# Altium project GPIO_Module.PrjPcb
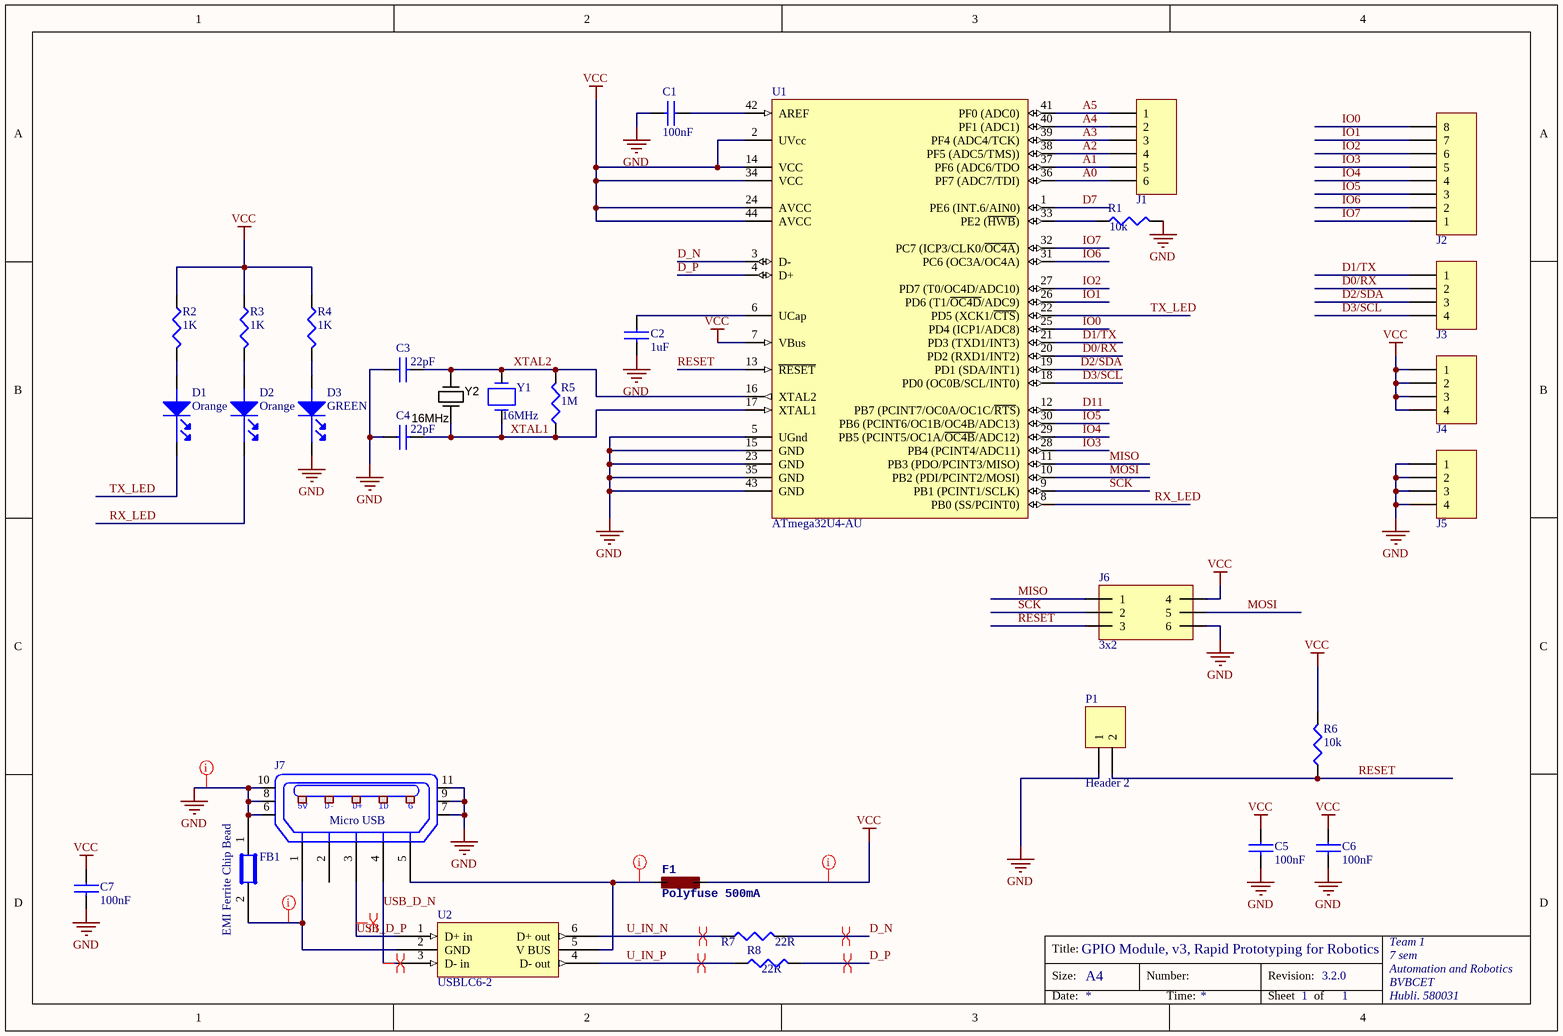
[diagram p0: schematic.SchDoc]
1 sheet, 32 parts. Net scope: global (net labels, ports and power ports of the same name join across sheets).
Board file: pcb.PcbDoc

## Sheet schematic.SchDoc
size A4; Organization: Team 1; Address1: 7 sem; Address2: Automation and Robotics; Address3: BVBCET; Address4: Hubli. 580031

### Parts
C1  100nF  [C0805]
C2  1uF  [C0805]
C3  22pF  [C0805]
C4  22pF  [C0805]
C5  100nF  [C0805]
C6  100nF  [C0805]
C7  100nF  [C0805]
D1  Orange  [LED_0603]
D2  Orange  [LED_0603]
D3  GREEN  [LED_0603]
F1  Polyfuse 500mA  [L1812]
FB1  EMI Ferrite Chip Bead  [C0805]
J1  06p  [61300611821]  (value not drawn)
J2  08p  [61300811821]  (value not drawn)
J3  04p  [61300411821]  (value not drawn)
J4  04p  [61300411821]  (value not drawn)
J5  04p  [61300411821]  (value not drawn)
J6  3x2  [Male 3x2]
J7  Micro USB  [10118193]
P1  Header 2  [HDR1X2]
R1  10k  [R0805]
R2  1K  [R0805]
R3  1K  [R0805]
R4  1K  [R0805]
R5  1M  [R0805]
R6  10k  [R0805]
R7  22R  [R0805]
R8  22R  [R0805]
U1  ATmega32U4-AU  [44ML_M]
U2  USBLC6-2  [TSOT23-6]
Y1  16MHz  [ABM7_v1_1_BIG]
Y2  16MHz  [CRYSTAL_HC49-US-SM]

### Nets
GND: C1.2 C2.2 C3.1 C4.1 C5.2 C6.2 C7.2 D3.1(cathode) FB1.1 J5.1 J5.2 J5.3 J5.4 J6.6 J7.6 J7.7 J7.8 J7.9 J7.10 J7.11 P1.1 R1.2 U1.5(UGnd) U1.15(GND) U1.23(GND) U1.35(GND) U1.43(GND)
VCC: C5.1 C6.1 C7.1 F1.2 J4.1 J4.2 J4.3 J4.4 J6.4 R2.1 R3.1 R4.1 R6.2 U1.2(UVcc) U1.7(VBus) U1.14(VCC) U1.24(AVCC) U1.34(VCC) U1.44(AVCC)
A0: J1.6 U1.36(PF7_(ADC7/TDI))
A1: J1.5 U1.37(PF6_(ADC6/TDO)
A2: J1.4 U1.38(PF5_(ADC5/TMS)))
A3: J1.3 U1.39(PF4_(ADC4/TCK))
A4: J1.2 U1.40(PF1_(ADC1))
A5: J1.1 U1.41(PF0_(ADC0))
D0/RX: J3.2 U1.20(PD2_(RXD1/INT2))
D1/TX: J3.1 U1.21(PD3_(TXD1/INT3))
D2/SDA: J3.3 U1.19(PD1_(SDA/INT1))
D3/SCL: J3.4 U1.18(PD0_(OC0B/SCL/INT0))
D7: U1.1(PE6_(INT.6/AIN0))
D11: U1.12(PB7_(PCINT7/OC0A/OC1C/~{RTS}))
D_N: R7.2 U1.3(D-)
D_P: R8.2 U1.4(D+)
IO0: J2.8 U1.25(PD4_(ICP1/ADC8))
IO1: J2.7 U1.26(PD6_(T1/~{OC4D}/ADC9))
IO2: J2.6 U1.27(PD7_(T0/OC4D/ADC10))
IO3: J2.5 U1.28(PB4_(PCINT4/ADC11))
IO4: J2.4 U1.29(PB5_(PCINT5/OC1A/~{OC4B}/ADC12))
IO5: J2.3 U1.30(PB6_(PCINT6/OC1B/OC4B/ADC13))
IO6: J2.2 U1.31(PC6_(OC3A/OC4A))
IO7: J2.1 U1.32(PC7_(ICP3/CLK0/~{OC4A}))
MISO: J6.1 U1.11(PB3_(PDO/PCINT3/MISO))
MOSI: J6.5 U1.10(PB2_(PDI/PCINT2/MOSI))
RESET: J6.3 P1.2 R6.1 U1.13(~{RESET})
RX_LED: D2.1(cathode) U1.8(PB0_(SS/PCINT0))
SCK: J6.2 U1.9(PB1_(PCINT1/SCLK))
TX_LED: D1.1(cathode) U1.22(PD5_(XCK1/~{CTS}))
U_IN_N: R7.1 U2.6(D+_out)
U_IN_P: R8.1 U2.4(D-_out)
USB_D_N: J7.4(P4) U2.3(D-_in)
USB_D_P: J7.3(P3) U2.1(D+_in)
XTAL1: C4.2 R5.1 U1.17(XTAL1) Y1.1 Y2.1(IN)
XTAL2: C3.2 R5.2 U1.16(XTAL2) Y1.2 Y2.2(OUT)
NetC1_1: C1.1 U1.42(AREF)
NetC2_1: C2.1 U1.6(UCap)
NetD1_2: D1.2(ANODE) R2.2
NetD2_2: D2.2(ANODE) R3.2
NetD3_2: D3.2(ANODE) R4.2
NetF1_1: F1.1 J7.5(P5) U2.5(V_BUS)
NetFB1_2: FB1.2 J7.1(P1) U2.2(GND)
NetR1_1: R1.1 U1.33(PE2_(~{HWB}))

Not connected (* = marked no-connect by the designer): J7 2(P2)

### Layout directives
net class power_class: GND, NetF1_1, NetFB1_2, VCC
differential pair; net class USB: D_N, D_P, U_IN_N, U_IN_P
differential pair: USB_D_N, USB_D_P

### Notes on the sheet
- GPIO Module, v3, Rapid Prototyping for Robotics
- 3.2.0
- 1
- Title:
- Size:
- A4
- Number:
- Revision:
- Date:
- Time:
- Sheet
- of
- (in symbol 10118193-0001LF) 5V; D-; D+; ID; G

### Library data of the parts
C1 = C2012X5R1C106M: CAP CER 16V 20% X5R 0805; Manufacturer: TDK Corporation; Manufacturer Part Number: C2012X5R1C106M/1.25; Capacitance: 10µF; Voltage - Rated: 50V; .Checked PCB: used; Supplier 1: Digi-Key; Supplier Part Number 1: 445-4115-1-ND; RoHS: RoHS Compliant; Category: Capacitors; Stock 1: 66161; Pricing 1: 1=0.45, 10=0.357, 100=0.215, 250=0.16124, 500=0.1376, 1000=0.1075 (USD); Tolerance: ±20%; Temperature Coefficient: X5R; Mounting Type: Surface Mount, MLCC; Operating Temperature: -55°C ~ 85°C; Applications: General Purpose; Ratings: -; Package / Case: 0805 (2012 Metric); Size / Dimension: 0.079" L x 0.049" W (2.00mm x 1.25mm); Height - Seated (Max): -; Thickness (Max): 0.039" (1.00mm); Lead Spacing: -; Features: -; Packaging: Cut Tape (CT); Lead Style: -; ComponentLink1URL: http://www.tdk.com/pdf/general_B11.pdf; ComponentLink1Description: http://www.tdk.com/pdf/general_B11.pdf; .Checked SCH: used; value: 100nF
C2 = C2012X5R1C106M: CAP CER 16V 20% X5R 0805; Manufacturer: TDK Corporation; Manufacturer Part Number: C2012X5R1C106M/1.25; Capacitance: 10µF; .Checked PCB: used; Supplier 1: Digi-Key; Supplier Part Number 1: 445-4115-1-ND; RoHS: RoHS Compliant; Category: Capacitors; Stock 1: 66161; Pricing 1: 1=0.45, 10=0.357, 100=0.215, 250=0.16124, 500=0.1376, 1000=0.1075 (USD); Voltage - Rated: 16V; Tolerance: ±20%; Temperature Coefficient: X5R; Mounting Type: Surface Mount, MLCC; Operating Temperature: -55°C ~ 85°C; Applications: General Purpose; Ratings: -; Package / Case: 0805 (2012 Metric); Size / Dimension: 0.079" L x 0.049" W (2.00mm x 1.25mm); Height - Seated (Max): -; Thickness (Max): 0.039" (1.00mm); Lead Spacing: -; Features: -; Packaging: Cut Tape (CT); Lead Style: -; ComponentLink1URL: http://www.tdk.com/pdf/general_B11.pdf; ComponentLink1Description: http://www.tdk.com/pdf/general_B11.pdf; .Checked SCH: used; value: 1uF
C3 C4 = C0805C180J5GACTU: CAP CER 22pF 50V 5% NP0 0805; Manufacturer: Kemet; Capacitance: 18pF; Temperature Coefficient: C0G, NP0; .Creator: MM; .Checked PCB: RF; Supplier 1: Digi-Key; Manufacturer Part Number: C0805C180J5GACTU; RoHS: RoHS Compliant; Category: Capacitors; Stock 1: 39241; Pricing 1: 1=0.11, 10=0.083, 25=0.0588, 50=0.045, 100=0.0381, 250=0.0312, 1000=0.0204 (USD); Packaging: Cut Tape (CT); Tolerance: ±5%; Voltage - Rated: 50V; Mounting Type: Surface Mount, MLCC; Operating Temperature: -55°C ~ 125°C; Applications: General Purpose; Ratings: -; Package / Case: 0805 (2012 Metric); Size / Dimension: 0.079" L x 0.049" W (2.00mm x 1.25mm); Height - Seated (Max): -; Thickness (Max): 0.035" (0.88mm); Lead Spacing: -; Features: -; Lead Style: -; ComponentLink1URL: http://www.kemet.com/docfinder?Partnumber=C0805C180J5GACTU; ComponentLink1Description: http://www.kemet.com/docfinder?Partnumber=C0805C180J5GACTU; Supplier Part Number 1: 399-1112-1-ND; .Checked SCH: RF; value: 22pF
C5-C7 = C2012X7R1H104K085AA: CAP CER 0.1UF 50V 10% X7R 0805; Manufacturer: TDK Corporation; Capacitance: 0.1µF; .Creator: MM; .Checked PCB: RF; Supplier 1: Digi-Key; Manufacturer Part Number: C2012X7R1H104K085AA; RoHS: RoHS Compliant; Category: Capacitors; Stock 1: 818066; Pricing 1: 1=0.1, 10=0.066, 100=0.0303, 250=0.02476, 500=0.02118, 1000=0.0165 (USD); Packaging: Cut Tape (CT); Tolerance: ±10%; Voltage - Rated: 50V; Temperature Coefficient: X7R; Mounting Type: Surface Mount, MLCC; Operating Temperature: -55°C ~ 125°C; Applications: General Purpose; Ratings: -; Package / Case: 0805 (2012 Metric); Size / Dimension: 0.079" L x 0.049" W (2.00mm x 1.25mm); Height - Seated (Max): -; Thickness (Max): 0.037" (0.95mm); Lead Spacing: -; Features: -; Lead Style: -; ComponentLink1URL: http://product.tdk.com/en/catalog/datasheets/mlcc_commercial_general_en.pdf; ComponentLink1Description: http://product.tdk.com/en/catalog/datasheets/mlcc_commercial_general_en.pdf; Supplier Part Number 1: 445-7534-1-ND; .Checked SCH: RF; value: 100nF
D1-D3 = LO L29K-H2K1-24-Z: LED SMARTLED ORANGE 606NM 0603; Manufacturer: OSRAM Opto Semiconductors Inc; Millicandela Rating: 6.3mcd; Voltage - Forward (Vf) Typ: 1.8V; Current - Test: 2mA; Wavelength - Peak: 610nm; Viewing Angle: 160°; Lens Type: Diffused; Lens Style/Size: Rectangle with Flat Top, 1.3mm x 0.8mm; Luminous Flux @ Current - Test: 25 mlm; .Checked PCB: used; Supplier 1: Digi-Key; Supplier Part Number 1: 475-2740-1-ND; Manufacturer Part Number: LO L29K-H2K1-24-Z; RoHS: RoHS Compliant; Category: Optoelectronics; Stock 1: 15900; Pricing 1: 1=0.17, 10=0.141, 100=0.1127, 250=0.0986, 500=0.09016 (USD); Color: Orange; Wavelength - Dominant: 606nm; Package / Case: 0603 (1608 Metric); Size / Dimension: 1.70mm L x 0.80mm W; Height: 0.65mm; Mounting Type: Surface Mount; Packaging: Cut Tape (CT); ComponentLink1URL: http://catalog.osram-os.com/catalogue/catalogue.do;jsessionid=302CF83AF637AE24E40AEB0ADA267EDD?act=downloadFile&favOid=020000010003f9de000100b6; ComponentLink1Description: http://catalog.osram-os.com/catalogue/catalogue.do;jsessionid=302CF83AF637AE24E40AEB0ADA267EDD?act=downloadFile&favOid=020000010003f9de000100b6; .Checked SCH: used
F1 = L-EUL1812
FB1 = MPZ2012S601AT000: Multilayer Ferrite Beads, Chip Beads in SMD 0805 package; Manufacturer: Bourns; Manufacturer Part Number: MH2029-300Y; Impedance: 30 Ohm; Current Rating: 3A; RoHS: RoHS Compliant; Category: Ferrite Beads; Package / Case: 0805 (2012 Metric); Mounting Type: Surface Mount
J1 = 61300611821: WR-PHD 2.54 mm Socket Header, 06p; PublishedDate: July 2016; Publisher: Wurth Elektronik; ComponentLink1Description: Manufacturer; ComponentLink1URL: http://www.we-online.de; ComponentLink2Description: Datasheet; ComponentLink2URL: http://katalog.we-online.de/em/datasheet/6130xx11821.pdf; PartNumber: 61300611821; PinNumber: 06p
J2 = 61300811821: WR-PHD 2.54 mm Socket Header, 08p; PublishedDate: July 2016; Publisher: Wurth Elektronik; ComponentLink1Description: Manufacturer; ComponentLink1URL: http://www.we-online.de; ComponentLink2Description: Datasheet; ComponentLink2URL: http://katalog.we-online.de/em/datasheet/6130xx11821.pdf; PartNumber: 61300811821; PinNumber: 08p
J3-J5 = 61300411821: WR-PHD 2.54 mm Socket Header, 04p; PublishedDate: July 2016; Publisher: Wurth Elektronik; ComponentLink1Description: Manufacturer; ComponentLink1URL: http://www.we-online.de; ComponentLink2Description: Datasheet; ComponentLink2URL: http://katalog.we-online.de/em/datasheet/6130xx11821.pdf; PartNumber: 61300411821; PinNumber: 04p
J6 = 3x2: 3x2 100mil Header
J7 = 10118193-0001LF: CONN USB MICRO B RECPT SMT R/A; Manufacturer: FCI; Connector Type: USB - micro B; Number of Contacts: 5; Gender: Receptacle; Specifications: USB 2.0; .Creator: MM; .Checked PCB: RF; Supplier 1: Digi-Key; Manufacturer Part Number: 10118193-0001LF; RoHS: RoHS Compliant; Category: Connectors, Interconnects; Stock 1: 28642; Pricing 1: 1=0.46, 10=0.433, 25=0.3712, 50=0.3156, 100=0.3032, 250=0.27224, 500=0.25988 (USD); Packaging: Cut Tape (CT); Mounting Type: Surface Mount, Right Angle, Horizontal; Features: Shielded, Solder Retention; Ingress Protection: -; ComponentLink1URL: http://portal.fciconnect.com/Comergent//fci/drawing/10118193.pdf; ComponentLink1Description: http://portal.fciconnect.com/Comergent//fci/drawing/10118193.pdf; Supplier Part Number 1: 609-4616-1-ND; .Checked SCH: MM
P1 = Header 2: Header, 2-Pin; LatestRevisionDate: 17-Jul-2002; LatestRevisionNote: Re-released for DXP Platform.; Publisher: Altium Limited
R1 R6 = RC0805FR-0710KL: RES SMD 10K OHM 1% 1/8W 0805; Manufacturer: Yageo; Power (Watts): 0.125W, 1/8W; Temperature Coefficient: ±100ppm/°C; .Creator: MM; .Checked PCB: RF; Supplier 1: Digi-Key; Manufacturer Part Number: RC0805FR-0710KL; RoHS: RoHS Compliant; Category: Resistors; Stock 1: 4094384; Pricing 1: 1=0.1, 10=0.021, 25=0.0148, 100=0.0084, 250=0.0064, 500=0.0051, 1000=0.00376, 2500=0.00326 (USD); Packaging: Cut Tape (CT); Resistance (Ohms): 10k; Tolerance: ±1%; Composition: Thick Film; Features: Moisture Resistant; Operating Temperature: -55°C ~ 155°C; Package / Case: 0805 (2012 Metric); Supplier Device Package: 0805; Size / Dimension: 0.079" L x 0.049" W (2.00mm x 1.25mm); Height: 0.024" (0.60mm); Number of Terminations: 2; ComponentLink1URL: http://www.yageo.com/documents/recent/PYu-RC_Group_51_RoHS_L_1.pdf; ComponentLink1Description: http://www.yageo.com/documents/recent/PYu-RC_Group_51_RoHS_L_1.pdf; Supplier Part Number 1: 311-10.0KCRCT-ND; .Checked SCH: RF; value: 10k
R2-R4 = RC0805FR-071KL: RES SMD 1K OHM 1% 1/8W 0805; Manufacturer: Yageo; Power (Watts): 0.125W, 1/8W; Temperature Coefficient: ±100ppm/°C; .Creator: MM; .Checked PCB: RF; Supplier 1: Digi-Key; Manufacturer Part Number: RC0805FR-071KL; RoHS: RoHS Compliant; Category: Resistors; Stock 1: 3497185; Pricing 1: 1=0.1, 10=0.021, 25=0.0148, 100=0.0084, 250=0.0064, 500=0.0051, 1000=0.00376, 2500=0.00326 (USD); Packaging: Cut Tape (CT); Resistance (Ohms): 1k; Tolerance: ±1%; Composition: Thick Film; Features: Moisture Resistant; Operating Temperature: -55°C ~ 155°C; Package / Case: 0805 (2012 Metric); Supplier Device Package: 0805; Size / Dimension: 0.079" L x 0.049" W (2.00mm x 1.25mm); Height: 0.024" (0.60mm); Number of Terminations: 2; ComponentLink1URL: http://www.yageo.com/documents/recent/PYu-RC_Group_51_RoHS_L_1.pdf; ComponentLink1Description: http://www.yageo.com/documents/recent/PYu-RC_Group_51_RoHS_L_1.pdf; Supplier Part Number 1: 311-1.00KCRCT-ND; .Checked SCH: RF; value: 1K
R5 = RC0805FR-071ML: RES SMD 1M OHM 1% 1/8W 0805; Manufacturer: Yageo; Power (Watts): 0.125W, 1/8W; Temperature Coefficient: ±100ppm/°C; .Creator: MM; .Checked PCB: RF; Supplier 1: Digi-Key; Manufacturer Part Number: RC0805FR-071ML; RoHS: RoHS Compliant; Category: Resistors; Stock 1: 449644; Pricing 1: 1=0.1, 10=0.021, 25=0.0148, 100=0.0084, 250=0.0064, 500=0.0051, 1000=0.00376, 2500=0.00326 (USD); Packaging: Cut Tape (CT); Resistance (Ohms): 1M; Tolerance: ±1%; Composition: Thick Film; Features: Moisture Resistant; Operating Temperature: -55°C ~ 155°C; Package / Case: 0805 (2012 Metric); Supplier Device Package: 0805; Size / Dimension: 0.079" L x 0.049" W (2.00mm x 1.25mm); Height: 0.024" (0.60mm); Number of Terminations: 2; ComponentLink1URL: http://www.yageo.com/documents/recent/PYu-RC_Group_51_RoHS_L_1.pdf; ComponentLink1Description: http://www.yageo.com/documents/recent/PYu-RC_Group_51_RoHS_L_1.pdf; Supplier Part Number 1: 311-1.00MCRCT-ND; .Checked SCH: RF; value: 1M
R7 R8 = RC0805FR-0722RL: RES SMD 22 OHM 1% 1/8W 0805; Manufacturer: Yageo; Resistance (Ohms): 22; Power (Watts): 0.125W, 1/8W; Temperature Coefficient: ±100ppm/°C; .Creator: MM; .Checked PCB: RF; Supplier 1: Digi-Key; Manufacturer Part Number: RC0805FR-0722RL; RoHS: RoHS Compliant; Category: Resistors; Stock 1: 63849; Pricing 1: 1=0.1, 10=0.021, 25=0.0148, 100=0.0084, 250=0.0064, 500=0.0051, 1000=0.00376, 2500=0.00326 (USD); Packaging: Cut Tape (CT); Tolerance: ±1%; Composition: Thick Film; Features: Moisture Resistant; Operating Temperature: -55°C ~ 155°C; Package / Case: 0805 (2012 Metric); Supplier Device Package: 0805; Size / Dimension: 0.079" L x 0.049" W (2.00mm x 1.25mm); Height: 0.024" (0.60mm); Number of Terminations: 2; ComponentLink1URL: http://www.yageo.com/documents/recent/PYu-RC_Group_51_RoHS_L_1.pdf; ComponentLink1Description: http://www.yageo.com/documents/recent/PYu-RC_Group_51_RoHS_L_1.pdf; Supplier Part Number 1: 311-22.0CRCT-ND; .Checked SCH: RF; value: 22R
U1 = ATmega32U4-AU: 8-bit AVR Microcontroller, 2.7-5.5V, 32KB Flash, 2.5KB EEPROM, 1KB SRAM, USB Controller, 44-pin TQFP, Industrial Grade (-40°C to 85°C); Published: 1-Apr-2010; DatasheetVersion: revD, Jan-2009; PackageVersion: rev.G, Jul-2007; PackageReference: 44ML; Publisher: Altium Limited; PackageDescription: 44-Pin Plastic Thin Quad Flat Pack, 10 x 10 x 1.0 mm Body, 0.8 mm Pitch (TQFP); Supplier 1: Digi-Key; Supplier Part Number 1: ATMEGA32U4-AU-ND; Supplier 2: Farnell; Supplier Part Number 2: 1748525; Supplier 3: Mouser; Supplier Part Number 3: 556-ATMEGA32U4-AU; ComponentLink1Description: Manufacturer Link; ComponentLink1URL: http://www.atmel.com/products/avr/default.asp?; ComponentLink2Description: ATmega16U4/32U4 Datasheet; ComponentLink2URL: http://www.atmel.com/dyn/resources/prod_documents/doc7766.pdf; ComponentLink3Description: ATmega16U4 ATmega32U4 Summary; ComponentLink3URL: http://www.atmel.com/dyn/resources/prod_documents/7766S.pdf; ComponentLink4Description: Atmel.com Home; ComponentLink4URL: http://www.atmel.com
Y1 = ABM7-16.000MHZ-D2Y-T: CRYSTAL 16MHZ 18PF SMD; Manufacturer: Abracon LLC; Frequency Stability: ±30ppm; Frequency Tolerance: ±20ppm; ESR (Equivalent Series Resistance): 50 Ohm; Operating Mode: Fundamental; .Creator: MM; .Checked PCB: RF; Supplier 1: Digi-Key; Manufacturer Part Number: ABM7-16.000MHZ-D2Y-T; RoHS: RoHS Compliant; Category: Crystals and Oscillators; Stock 1: 5861; Pricing 1: 1=0.96, 10=0.847, 50=0.791, 100=0.7, 500=0.6615 (USD); Packaging: Cut Tape (CT); Type: MHz Crystal; Frequency: 16MHz; Load Capacitance: 18pF; Operating Temperature: -40°C ~ 85°C; Ratings: -; Mounting Type: Surface Mount; Package / Case: 2-SMD; Size / Dimension: 0.236" L x 0.138" W (6.00mm x 3.50mm); Height: 0.055" (1.40mm); ComponentLink1URL: http://www.abracon.com/Resonators/abm7.pdf; ComponentLink1Description: http://www.abracon.com/Resonators/abm7.pdf; Supplier Part Number 1: 535-9840-1-ND; .Checked SCH: RF; value: 16MHz
Y2 = Crystal_6MHz_HC49/US: Resonator Ceramic 6.00 MHz 30ppm; Manufacturer 1: CTS-Frequency Controls; Manufacturer Part Number 1: ATS060BSM-1; Frequency: 6MHz; Frequency Stability: ±50ppm; Load Capacitance: 18pF; Operating Mode: Fundamental; Parameter Name: 0.169" (4.30mm); SCDType: spec; Package / Case: HC49/US-SM; Ratings: 6.00 MHz; Supplier 1: Digi-Key; Supplier Part Number 1: CTX882CT-ND; Type: MHz Crystal; Frequency Tolerance: ±30ppm; Operating Temperature: -20°C ~ 70°C; Mounting Type: Surface Mount; Size / Dimension: 0.437" L x 0.190" W (11.10mm x 4.83mm); ComponentLink1URL: http://www.ctscorp.com/components/Datasheets/008-0309-0.pdf; ComponentLink1Description: http://www.ctscorp.com/components/Datasheets/008-0309-0.pdf